# EAGLE design CurrentMonitorOnAStick (EAGLE 7.4.0)
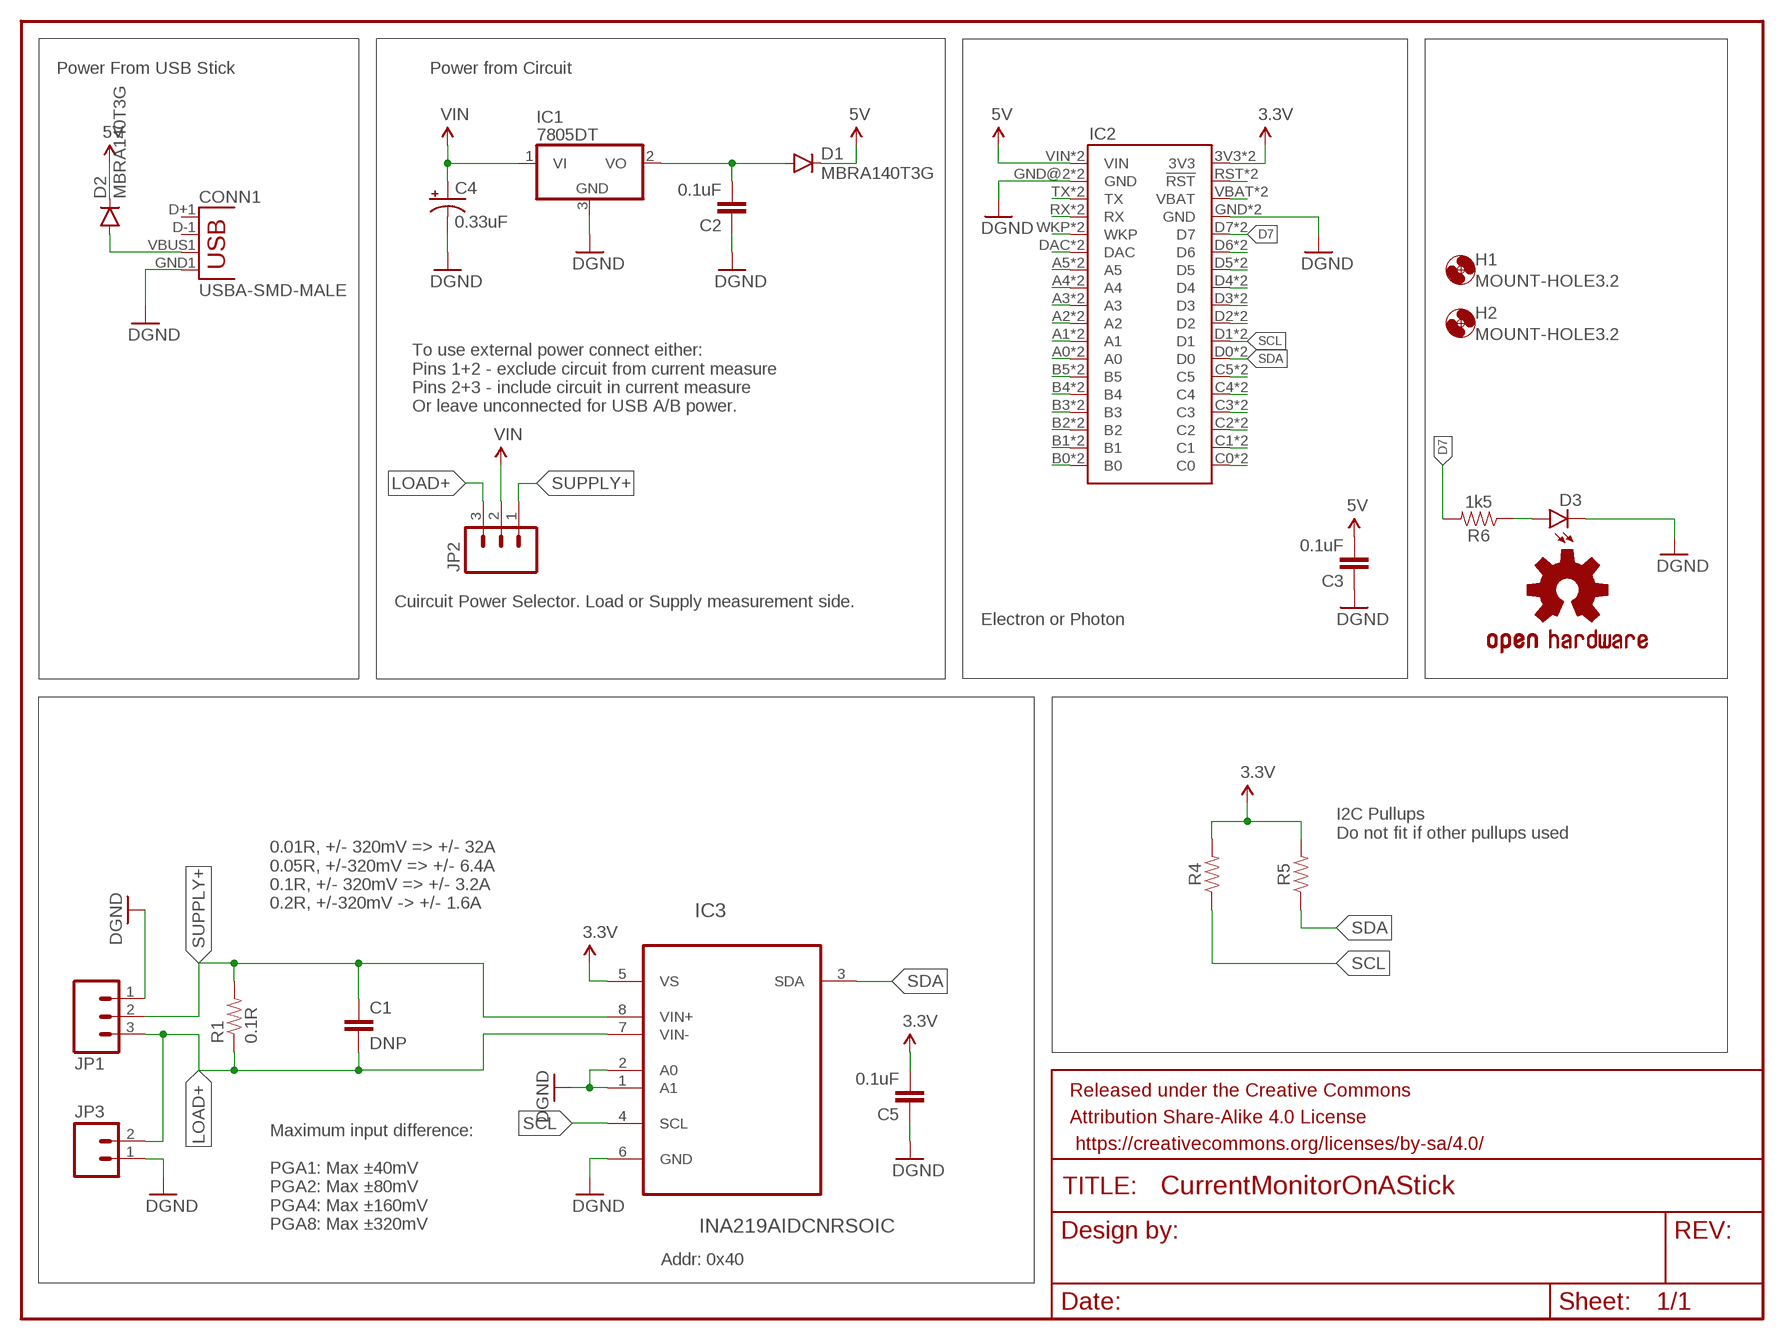
[diagram p0: schematic, sheet 1]

## Parts
C1  DNP  CAP0805  [0805]
C2  0.1uF  CAP0805  [0805]
C3  0.1uF  CAP0805  [0805]
C4  0.33uF  10UF-16V-10%(TANT)  [EIA3216]
C5  0.1uF  CAP0805  [0805]
CONN1  USBA-SMD-MALE  [USB-A-SMT-MALE]
D1  MBRA140T3G  DIODESMA  [SMA-DIODE]
D2  MBRA140T3G  DIODESMA  [SMA-DIODE]
D3  LED1206-BOTTOM  [LED-1206-BOTTOM]
FRAME2  FRAME-LETTER  [CREATIVE_COMMONS]
H1  MOUNT-HOLE3.2  [3,2]
H2  MOUNT-HOLE3.2  [3,2]
IC1  7805DT  [TO252]
IC2  ELECTRONDUALNAMED  [ELECTRON_SIMPLE_SILK_NAMES_DUAL]
IC3  INA219AIDCNRSOIC  [SO08]
JP1  M03-SCREW-5MM  [SCREWTERMINAL-5MM-3]
JP2  M03PTH  [1X03]
JP3  M025MM  [SCREWTERMINAL-5MM-2]
LOGO1  OSHW-LOGOM  [OSHW-LOGO-M]
R1  0.1R  0.001OHM-3W-1%(2512)3W/1%  [2512]
R4  RESISTOR0805  [0805]
R5  RESISTOR0805  [0805]
R6  1k5  RESISTOR0805  [0805]

## Nets
3.3V: C5.2 IC2.3V3 IC2.3V3_1(3V3) IC3.5(VS) R4.2 R5.2
5V: C3.2 D1.C D2.C IC2.VIN IC2.VIN_1B(VIN)
D7: IC2.D7 IC2.D7_1(D7) R6.2
GND: C2.1 C3.1 C4.C(-) C5.1 CONN1.GND1(GND) D3.C IC1.3(GND) IC2.GND IC2.GND@2(GND) IC2.GND_1(GND) IC2.GND_1B(GND) IC3.1(A1) IC3.2(A0) IC3.6(GND) JP1.1 JP3.1 ; supply symbol labelled DGND
LOAD+: C1.2 IC3.7(VIN-) JP1.3 JP2.3 JP3.2 R1.1
N$1: CONN1.VBUS1(VBUS) D2.A
N$3: C2.2 D1.A IC1.2(VO)
N$6: IC2.VBAT IC2.VBATT_1(VBAT)
N$7: IC2.RST(!RST) IC2.RST_1(!RST)
N$13: D3.A R6.1
N$15: IC2.D6 IC2.D6_1(D6)
N$16: IC2.D5 IC2.D5_1(D5)
N$20: IC2.D4 IC2.D4_1(D4)
N$21: IC2.D3 IC2.D3_1(D3)
N$22: IC2.D2 IC2.D2_1(D2)
N$23: IC2.C5 IC2.C5_1(C5)
N$24: IC2.C4 IC2.C4_1(C4)
N$25: IC2.C3 IC2.C3_1(C3)
N$26: IC2.C2 IC2.C2_1(C2)
N$28: IC2.C1 IC2.C1_1(C1)
N$29: IC2.C0 IC2.C0_1(C0)
N$31: IC2.B0 IC2.B0_1(B0)
N$33: IC2.B1 IC2.B1_1(B1)
N$35: IC2.B2 IC2.B2_1(B2)
N$36: IC2.B3 IC2.B3_1(B3)
N$37: IC2.B4 IC2.B4_1(B4)
N$38: IC2.B5 IC2.B5_1(B5)
N$39: IC2.A0 IC2.A0_1(A0)
N$40: IC2.A1 IC2.A1_1(A1)
N$41: IC2.A2 IC2.A2_1(A2)
N$42: IC2.A3 IC2.A3_1(A3)
N$43: IC2.A4 IC2.A4_1(A4)
N$44: IC2.A5 IC2.A5_1(A5)
N$45: IC2.DAC IC2.DAC_1(DAC)
N$46: IC2.WKP IC2.WKP_1(WKP)
N$47: IC2.RX IC2.RX_1(RX)
N$48: IC2.TX IC2.TX_1(TX)
SCL: IC2.D1 IC2.D1_1(D1) IC3.4(SCL) R4.1
SDA: IC2.D0 IC2.D0_1(D0) IC3.3(SDA) R5.1
SUPPLY+: C1.1 IC3.8(VIN+) JP1.2 JP2.1 R1.2
VIN: C4.A(+) IC1.1(VI) JP2.2
Unconnected: CONN1.D+1(D+) CONN1.D-1(D-)

## Notes on the sheet
- Power From USB Stick | Power from Circuit
- To use external power connect either:
  Pins 1+2 - exclude circuit from current measure
  Pins 2+3 - include circuit in current measure
  Or leave unconnected for USB A/B power.
- Cuircuit Power Selector. Load or Supply measurement side.
- Electron or Photon
- I2C Pullups
  Do not fit if other pullups used
- 0.01R, +/- 320mV => +/- 32A
  0.05R, +/-320mV => +/- 6.4A
  0.1R, +/- 320mV => +/- 3.2A
  0.2R, +/-320mV -> +/- 1.6A
- Maximum input difference:
  
  PGA1: Max ±40mV
  PGA2: Max ±80mV
  PGA4: Max ±160mV
  PGA8: Max ±320mV
- Addr: 0x40

## Library data of the parts
C1 = SparkFun-Capacitors:CAP: Capacitor Standard 0603 ceramic capacitor, and 0.1" leaded capacitor.
C2 C3 C5 = SparkFun-Passives:CAP: Capacitor Standard 0603 ceramic capacitor, and 0.1" leaded capacitor.
C4 = SparkFun-Capacitors:10UF-16V-10%(TANT): CAP-00811 1206/EIA-3216 Tantalum capacitor; PROD_ID: CAP-00811; VALUE: 10uF
CONN1 = SparkFun-Connectors:USB: USB Connectors USB-B-PTH is fully proven SKU : PRT-00139/CONN-08278 USB-miniB is fully proven SKU : PRT-00587 USB-A-PCB is untested. USB-A-H is throughly reviewed, but untested. Spark Fun Electronics SKU : PRT-00437 USB-B-SMT is throughly reviewed, but untested. Needs silkscreen touching up. USB-A-S has not been used/tested USB-MB-H has not been used/tested USB-MICROB has been used. CONN-09505
D1 D2 = SparkFun-DiscreteSemi:DIODE: Diode These are standard reverse protection diodes and small signal diodes. SMA package can handle up to about 1A. SOD-323 can handle about 200mA. What the SOD-323 package when ordering, there are some mfgs out there that are 5-pin packages.
D3 = SparkFun-LED:LED: LEDs Standard schematic elements and footprints for 5mm, 3mm, 1206, and 0603 sized LEDs. 5mm - Spark Fun Electronics SKU : COM-00529 (and others)
FRAME2 = SparkFun-Aesthetics:FRAME-LETTER: Schematic Frame Standard 8.5x11 US Letter frame
H1 H2 = holes:MOUNT-HOLE: MOUNTING HOLE with drill center marker
IC1 = linear:78*: Positive VOLTAGE REGULATOR Source: http://cache.national.com/ds/LM/LM78L05.pdf http://www.fairchildsemi.com/ds/LM/LM7805.pdf
IC2 = Tinamous:ELECTRON
IC3 = INA219AIDCNR:INA219AIDCNR: CURRENT/POWER MONITOR
JP1 = SparkFun-Connectors:M03: Header 3 Standard 3-pin 0.1" header. Use with straight break away headers (SKU : PRT-00116), right angle break away headers (PRT-00553), swiss pins (PRT-00743), machine pins (PRT-00117), and female headers (PRT-00115). Molex polarized connector foot print use with SKU : PRT-08232 with associated crimp pins and housings.; STOREFRONT_ID: PRT-08433
JP2 = SparkFun-Connectors:M03: Header 3 Standard 3-pin 0.1" header. Use with straight break away headers (SKU : PRT-00116), right angle break away headers (PRT-00553), swiss pins (PRT-00743), machine pins (PRT-00117), and female headers (PRT-00115). Molex polarized connector foot print use with SKU : PRT-08232 with associated crimp pins and housings.
JP3 = SparkFun-Connectors:M02: Standard 2-pin 0.1" header. Use with - straight break away headers ( PRT-00116) - right angle break away headers (PRT-00553) - swiss pins (PRT-00743) - machine pins (PRT-00117) - female headers (PRT-00115) Molex polarized connector foot print use with: PRT-08233 with associated crimp pins and housings. 2.54_SCREWTERM for use with PRT-10571. 3.5mm Screw Terminal footprints for PRT-08084 5mm Screw Terminal footprints for use with PRT-08432; STOREFRONT_ID: PRT-08432
LOGO1 = SparkFun-Aesthetics:OSHW-LOGO: Open Source Hardware Logo This logo indicates the piece of hardware it is found on incorporates a OSHW license and/or adheres to the definition of open source hardware found here: http://freedomdefined.org/OSHW
R1 = SparkFun-Resistors:0.001OHM-3W-1%(2512); PROD_ID: RES-12449; VALUE: 0.001
R4-R6 = SparkFun-Resistors:RESISTOR: Generic Resistor Package

## Board
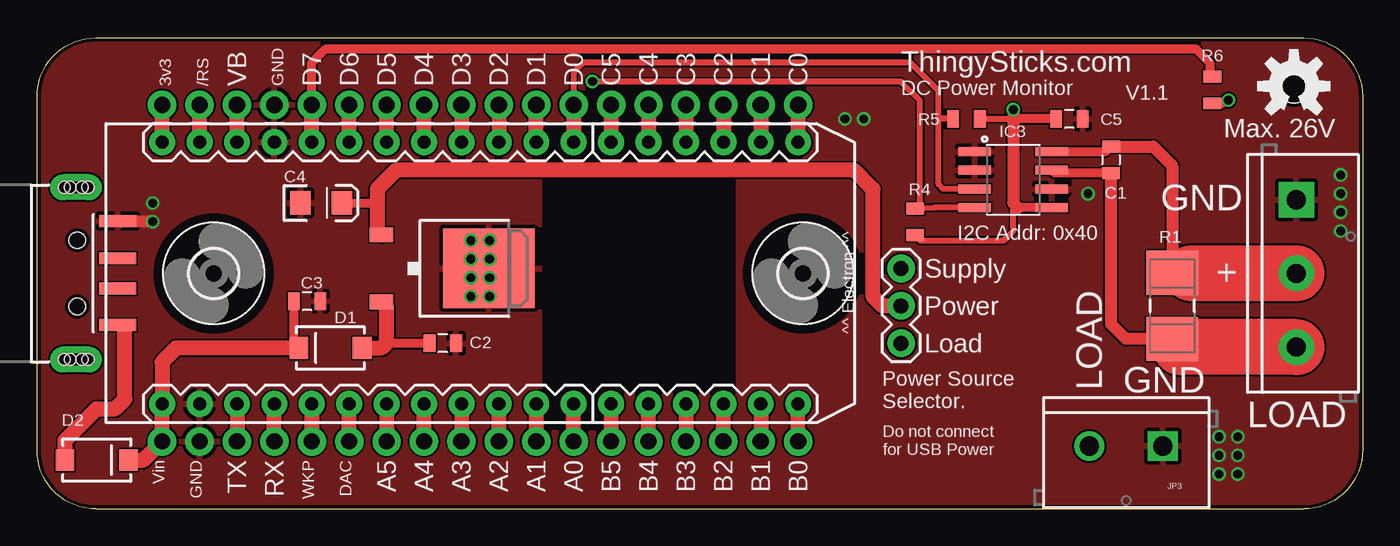
[diagram p1: board, top side]
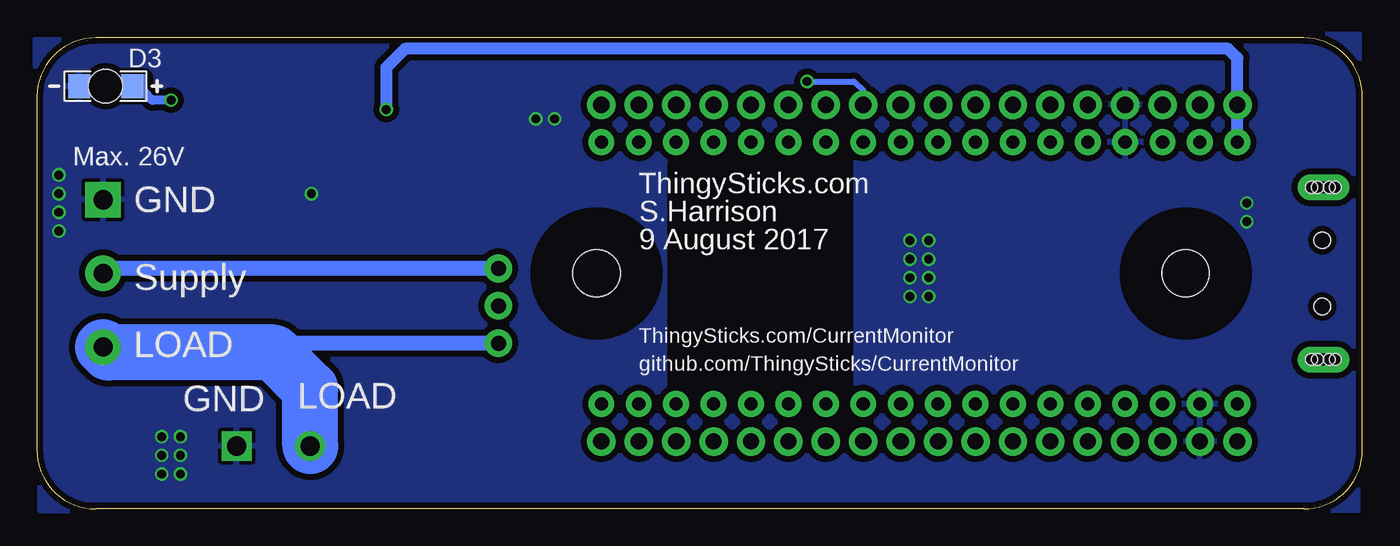
[diagram p2: board, bottom side, seen from below]

Size 90 x 32 mm. Coordinates in mm from the lower left corner, seen from the top.
Outline: 4,32 86,32 arc-90 90,28 90,4 arc-90 86,0 4,0 arc-90 0,4 0,28 arc-90 4,32
Copper layers (1*16): Top 0.035mm / dielectric 1.5mm / Bottom 0.035mm
Design rules "dirt_cheap_dirty_boards.v1": minimum track width 5mil, minimum drill 12mil, track to track 5mil, track to pad 5mil, pad to pad 5mil, via to via 5mil, smd to smd 0mil, copper to edge 10mil, drill to drill 10mil, minimum pad ring 10mil, minimum via ring 6mil, stop-mask expansion 2mil, vias tented up to drill 25mil, thermal gap 10mil
tRestrict: area 34.5,5.5 to 47.2,25.9
bRestrict: area 35.2,5.5 to 46.6,25.9

### Footprints (pad centres in the part's own frame; a part is rotated, then mirrored left to right if it is on the bottom)
0805 = smd 0.8 x 1.2: 1 -0.9,0; 2 0.9,0
EIA3216 = smd 1.4 x 1.6: A 1.4,0; C -1.4,0
USB-A-SMT-MALE = smd 0.8 x 2.5: D+1 1.027,-5.87; D-1 -1.027,-5.87; GND1 3.551,-5.87; VBUS1 -3.5,-5.87 | drill 0.8 pad 1.778 long: P$1 5.85,-3.05; P$3 -5.85,-3.05 | hole 1.1: 2.25,-3.12; -2.25,-3.12 | hole 0.8: -5.85,-3.45; -5.85,-3.85; -5.85,-2.65; -5.85,-2.25; 5.85,-3.45; 5.85,-3.85; 5.85,-2.65; 5.85,-2.25
SMA-DIODE = smd 1.27 x 1.47: A -2.15,0; C 2.15,0
LED-1206-BOTTOM = smd 1.5 x 1.6: A -1.8,0; C 1.8,0 | hole 2.3: 0,0
3,2 = hole 3.2: 0,0
TO252 = smd 1 x 1.6: 1 -2.28,-4.8; 2 2.28,-4.8 | smd 5.4 x 6.2: 3 0,2.5
ELECTRON_SIMPLE_SILK_NAMES_DUAL = drill 0.889 pad 1.753: 3V3 1.27,22.86; A0 29.21,5.08; A1 26.67,5.08; A2 24.13,5.08; A3 21.59,5.08; A4 19.05,5.08; A5 16.51,5.08; B0 44.45,5.08; B1 41.91,5.08; B2 39.37,5.08; B3 36.83,5.08; B4 34.29,5.08; B5 31.75,5.08; C0 44.45,22.86; C1 41.91,22.86; C2 39.37,22.86; C3 36.83,22.86; C4 34.29,22.86; C5 31.75,22.86; D0 29.21,22.86; D1 26.67,22.86; D2 24.13,22.86; D3 21.59,22.86; D4 19.05,22.86; D5 16.51,22.86; D6 13.97,22.86; D7 11.43,22.86; DAC 13.97,5.08; GND 8.89,22.86; GND@2 3.81,5.08; RST 3.81,22.86; RX 8.89,5.08; TX 6.35,5.08; VBAT 6.35,22.86; VIN 1.27,5.08; WKP 11.43,5.08 | drill 1.1 pad 1.93: 3V3_1 1.27,25.4; A0_1 29.21,2.54; A1_1 26.67,2.54; A2_1 24.13,2.54; A3_1 21.59,2.54; A4_1 19.05,2.54; A5_1 16.51,2.54; B0_1 44.45,2.54; B1_1 41.91,2.54; B2_1 39.37,2.54; B3_1 36.83,2.54; B4_1 34.29,2.54; B5_1 31.75,2.54; C0_1 44.45,25.4; C1_1 41.91,25.4; C2_1 39.37,25.4; C3_1 36.83,25.4; C4_1 34.29,25.4; C5_1 31.75,25.4; D0_1 29.21,25.4; D1_1 26.67,25.4; D2_1 24.13,25.4; D3_1 21.59,25.4; D4_1 19.05,25.4; D5_1 16.51,25.4; D6_1 13.97,25.4; D7_1 11.43,25.4; DAC_1 13.97,2.54; GND_1 8.89,25.4; GND_1B 3.81,2.54; RST_1 3.81,25.4; RX_1 8.89,2.54; TX_1 6.35,2.54; VBATT_1 6.35,25.4; VIN_1B 1.27,2.54; WKP_1 11.43,2.54
SO08 = smd 0.61 x 2.21: 1 -1.905,-2.616; 2 -0.635,-2.616; 3 0.635,-2.616; 4 1.905,-2.616; 5 1.905,2.616; 6 0.635,2.616; 7 -0.635,2.616; 8 -1.905,2.616
SCREWTERMINAL-5MM-3 = drill 1.3 pad 2.413 square: 1 0,0 | drill 1.3 pad 2.413: 2 5,0; 3 10,0
1X03 = drill 1.016 pad 1.88: 1 0,0; 2 2.54,0; 3 5.08,0
SCREWTERMINAL-5MM-2 = drill 1.3 pad 2.032 square: 1 0,0 | drill 1.3 pad 2.032: 2 5,0
2512 = smd 3 x 3.5: 1 -2.25,0; 2 2.25,0

### Placement (x,y rotation side)
C1  72.91,23.72 270 top
C2  27.55,11.26 180 top
C3  18.34,14.11 180 top
C4  19.29,20.78 0 top
C5  70.09,26.5 180 top
CONN1  -0.39,16 90 top
D1  19.92,10.94 180 top
D2  4.05,3.32 0 top
D3  85.33,28.72 180 bottom
FRAME2  13.57,-14.85 0 top  (outside the outline)
H1  12,16 0 top
H2  52,16 0 top
IC1  28.18,16.34 270 top
IC2  7.23,2.05 0 top
IC3  66.28,22.37 270 top
JP1  85.5,21 270 top
JP2  58.66,16.34 270 top
JP3  76.44,4.27 180 top
LOGO1  85.33,28.72 0 top
R1  77.08,13.79 90 top
R4  59.61,19.51 270 top
R5  63.11,26.5 0 top
R6  79.8,28.45 90 top

### Tracks (layer width: path | path; a pad name or v marks a point on that pad's centre or on a via)
3.3V  (via drill 0.6)
  Top 0.406: R4.2 59.67,18.51 59.93,18.24 65.64,18.24 66.28,18.88 66.28,20.78 66.28,21.1 | R5.2 66.28,26.5
  Top 0.61: IC3.5 66.6,20.46 | C5.2 66.28,26.5
  Top 0.813: v66.28,27.13 66.28,26.5 66.28,20.78 66.6,20.46
  Top 1.016: IC2.3V3 IC2.3V3_1
  Bottom 0.813: IC2.3V3 8.5,30.62 9.13,31.26 65.01,31.26 66.28,29.99 v66.28,27.13
5V
  Top 0.406: 17.38,10.62 17.46,10.62 D1.C
  Top 0.61: C3.2 17.44,11.28 D1.C
  Top 1.016: D2.C 7.23,3.32 IC2.VIN_1B IC2.VIN 8.5,9.98 9.45,10.94 D1.C
D7
  Top 0.61: IC2.D7_1 18.66,30.3 19.61,31.26 78.66,31.26 79.61,30.3 79.61,29.54 R6.2
  Top 1.016: IC2.D7 IC2.D7_1
GND  (via drill 0.6)
  Top 0.813: v7.86,19.51 5.73,19.51 CONN1.GND1
  other vias: 29.45,18.24 30.72,18.24 29.45,16.97 30.72,16.97 29.45,15.7 30.72,15.7 29.45,14.43 30.72,14.43 71.36,21.41 54.85,26.5 7.86,20.78 56.12,26.5 80.25,4.91 80.25,3.63 80.25,2.37 81.52,2.37 81.52,3.63 81.52,4.91 88.5,22.68 88.5,21.41 88.5,20.14 88.5,18.88
  pour Bottom (isolate 0.406): 0.22,32.25 90.12,31.84 89.8,-0.08 42.86,-0.3 35.16,-0.37 0.31,-0.07
  pour Top: -5.06,38.8 99.08,40.28 95.67,-13.5 -3.61,-12.26
LOAD+
  Top 0.406: 69.08,22.82 IC3.7 | 77.05,11.57 R1.1
  Top 0.61: C1.2 69.08,22.82
  Top 0.813: 78.61,12.26 78.98,11.89 R1.1 | C1.2 72.91,12.56 73.9,11.57 77.05,11.57
  Top 1.016: 76.78,11.26 R1.1
  Top 2.54: 77.63,11 R1.1
  Top 3.81: JP1.3 77.63,11
  Bottom 1.016: JP2.3 73.27,11.26 73.9,10.62
  Bottom 3.81: JP3.2 71.44,8.16 73.9,10.62 85.12,10.62 JP1.3
N$1
  Top 0.813: CONN1.VBUS1 5.95,12.2
  Top 1.016: D2.A 1.9,4.66 4.05,6.81 5.32,6.81 5.95,7.45 5.95,12.19 5.95,12.2
N$3
  Top 0.61: C2.2 23.73,11.26
  Top 1.016: D1.A 23.42,10.94 23.73,11.26 23.73,13.7 IC1.2
N$6
  Top 1.016: IC2.VBAT IC2.VBATT_1
N$7
  Top 1.016: IC2.RST IC2.RST_1
N$13  (via drill 0.6)
  Top 0.61: R6.1 80.46,27.55 v80.89,27.77
  Bottom 0.61: v80.89,27.77 82.16,27.77 82.79,28.4 82.79,29.25 D3.A
N$15
  Top 1.016: IC2.D6 IC2.D6_1
N$16
  Top 1.016: IC2.D5 IC2.D5_1
N$20
  Top 1.016: IC2.D4 IC2.D4_1
N$21
  Top 1.016: IC2.D3_1 IC2.D3
N$22
  Top 1.016: IC2.D2_1 IC2.D2
N$23
  Top 1.016: IC2.C5_1 IC2.C5
N$24
  Top 1.016: IC2.C4_1 IC2.C4
N$25
  Top 1.016: IC2.C3_1 IC2.C3
N$26
  Top 1.016: IC2.C2_1 IC2.C2
N$28
  Top 1.016: IC2.C1_1 IC2.C1
N$29
  Top 1.016: IC2.C0_1 IC2.C0
N$31
  Top 1.016: IC2.B0_1 IC2.B0
N$33
  Top 1.016: IC2.B1 IC2.B1_1
N$35
  Top 1.016: IC2.B2_1 IC2.B2
N$36
  Top 1.016: IC2.B3 IC2.B3_1
N$37
  Top 1.016: IC2.B4_1 IC2.B4
N$38
  Top 1.016: IC2.B5 IC2.B5_1
N$39
  Top 1.016: IC2.A0_1 IC2.A0
N$40
  Top 1.016: IC2.A1 IC2.A1_1
N$41
  Top 1.016: IC2.A2_1 IC2.A2
N$42
  Top 1.016: IC2.A3 IC2.A3_1
N$43
  Top 1.016: IC2.A4_1 IC2.A4
N$44
  Top 1.016: IC2.A5 IC2.A5_1
N$45
  Top 1.016: IC2.DAC_1 IC2.DAC
N$46
  Top 1.016: IC2.WKP IC2.WKP_1
N$47
  Top 1.016: IC2.RX_1 IC2.RX
N$48
  Top 1.016: IC2.TX IC2.TX_1
SCL  (via drill 0.6)
  Top 0.406: IC3.4 60.88,20.46 R4.1 59.93,20.73 59.93,27.77 58.66,29.04 v37.7,29.04
  Top 1.016: IC2.D1 IC2.D1_1
  Bottom 0.406: v37.7,29.04 34.53,29.04 33.9,28.4 IC2.D1_1
SDA
  Top 0.406: IC3.3 61.52,21.73 61.2,22.05 61.2,26.5 | 61.2,26.5 61.2,28.4 59.3,30.3 37.07,30.3 36.44,29.67 IC2.D0_1 | R5.1 61.2,26.5
  Top 1.016: IC2.D0_1 IC2.D0
SUPPLY+
  Top 0.406: 72.56,24.27 C1.1
  Top 0.61: IC3.8 72.56,24.27
  Top 0.813: C1.1 75.78,24.62 77.08,23.32 R1.2
  Top 1.016: 76.78,16.34 R1.2
  Top 2.54: 78.37,16 R1.2
  Top 3.81: JP1.2 78.37,16
  Bottom 1.016: JP2.1 85.17,16.34 JP1.2
VIN
  Top 0.61: C4.A 23.1,20.78
  Top 1.016: IC1.1 23.1,18.89 23.1,20.78 23.1,21.73 24.37,23 55.48,23 56.75,21.73 56.75,14.43 57.39,13.79 JP2.2

### Text on the board
tNames: ThingySticks.com | DC Power Monitor | V1.1 | Max. 26V | GND | I2C Addr: 0x40 | + | Supply | Power | ^^ Electron ^^ | Load | GND | LOAD | Power Source / Selector. | LOAD | Do not connect / for USB Power
bNames: Max. 26V | ThingySticks.com | S.Harrison | GND | 9 August 2017 | Supply | ThingySticks.com/CurrentMonitor | LOAD | github.com/ThingySticks/CurrentMonitor | GND | LOAD